# EasyEDA Pro project coBWeb.epro, schematic Schematic1

## Sheets
1 P1: Board Name: Board1; Create Date: 2025-08-11; Page Name: P1; Project Name: bwdevboard; Schematic Name: Schematic1; Update Date: 2025-08-13; Company: EasyEDA.com; Page Size: A4; Version: V1.0
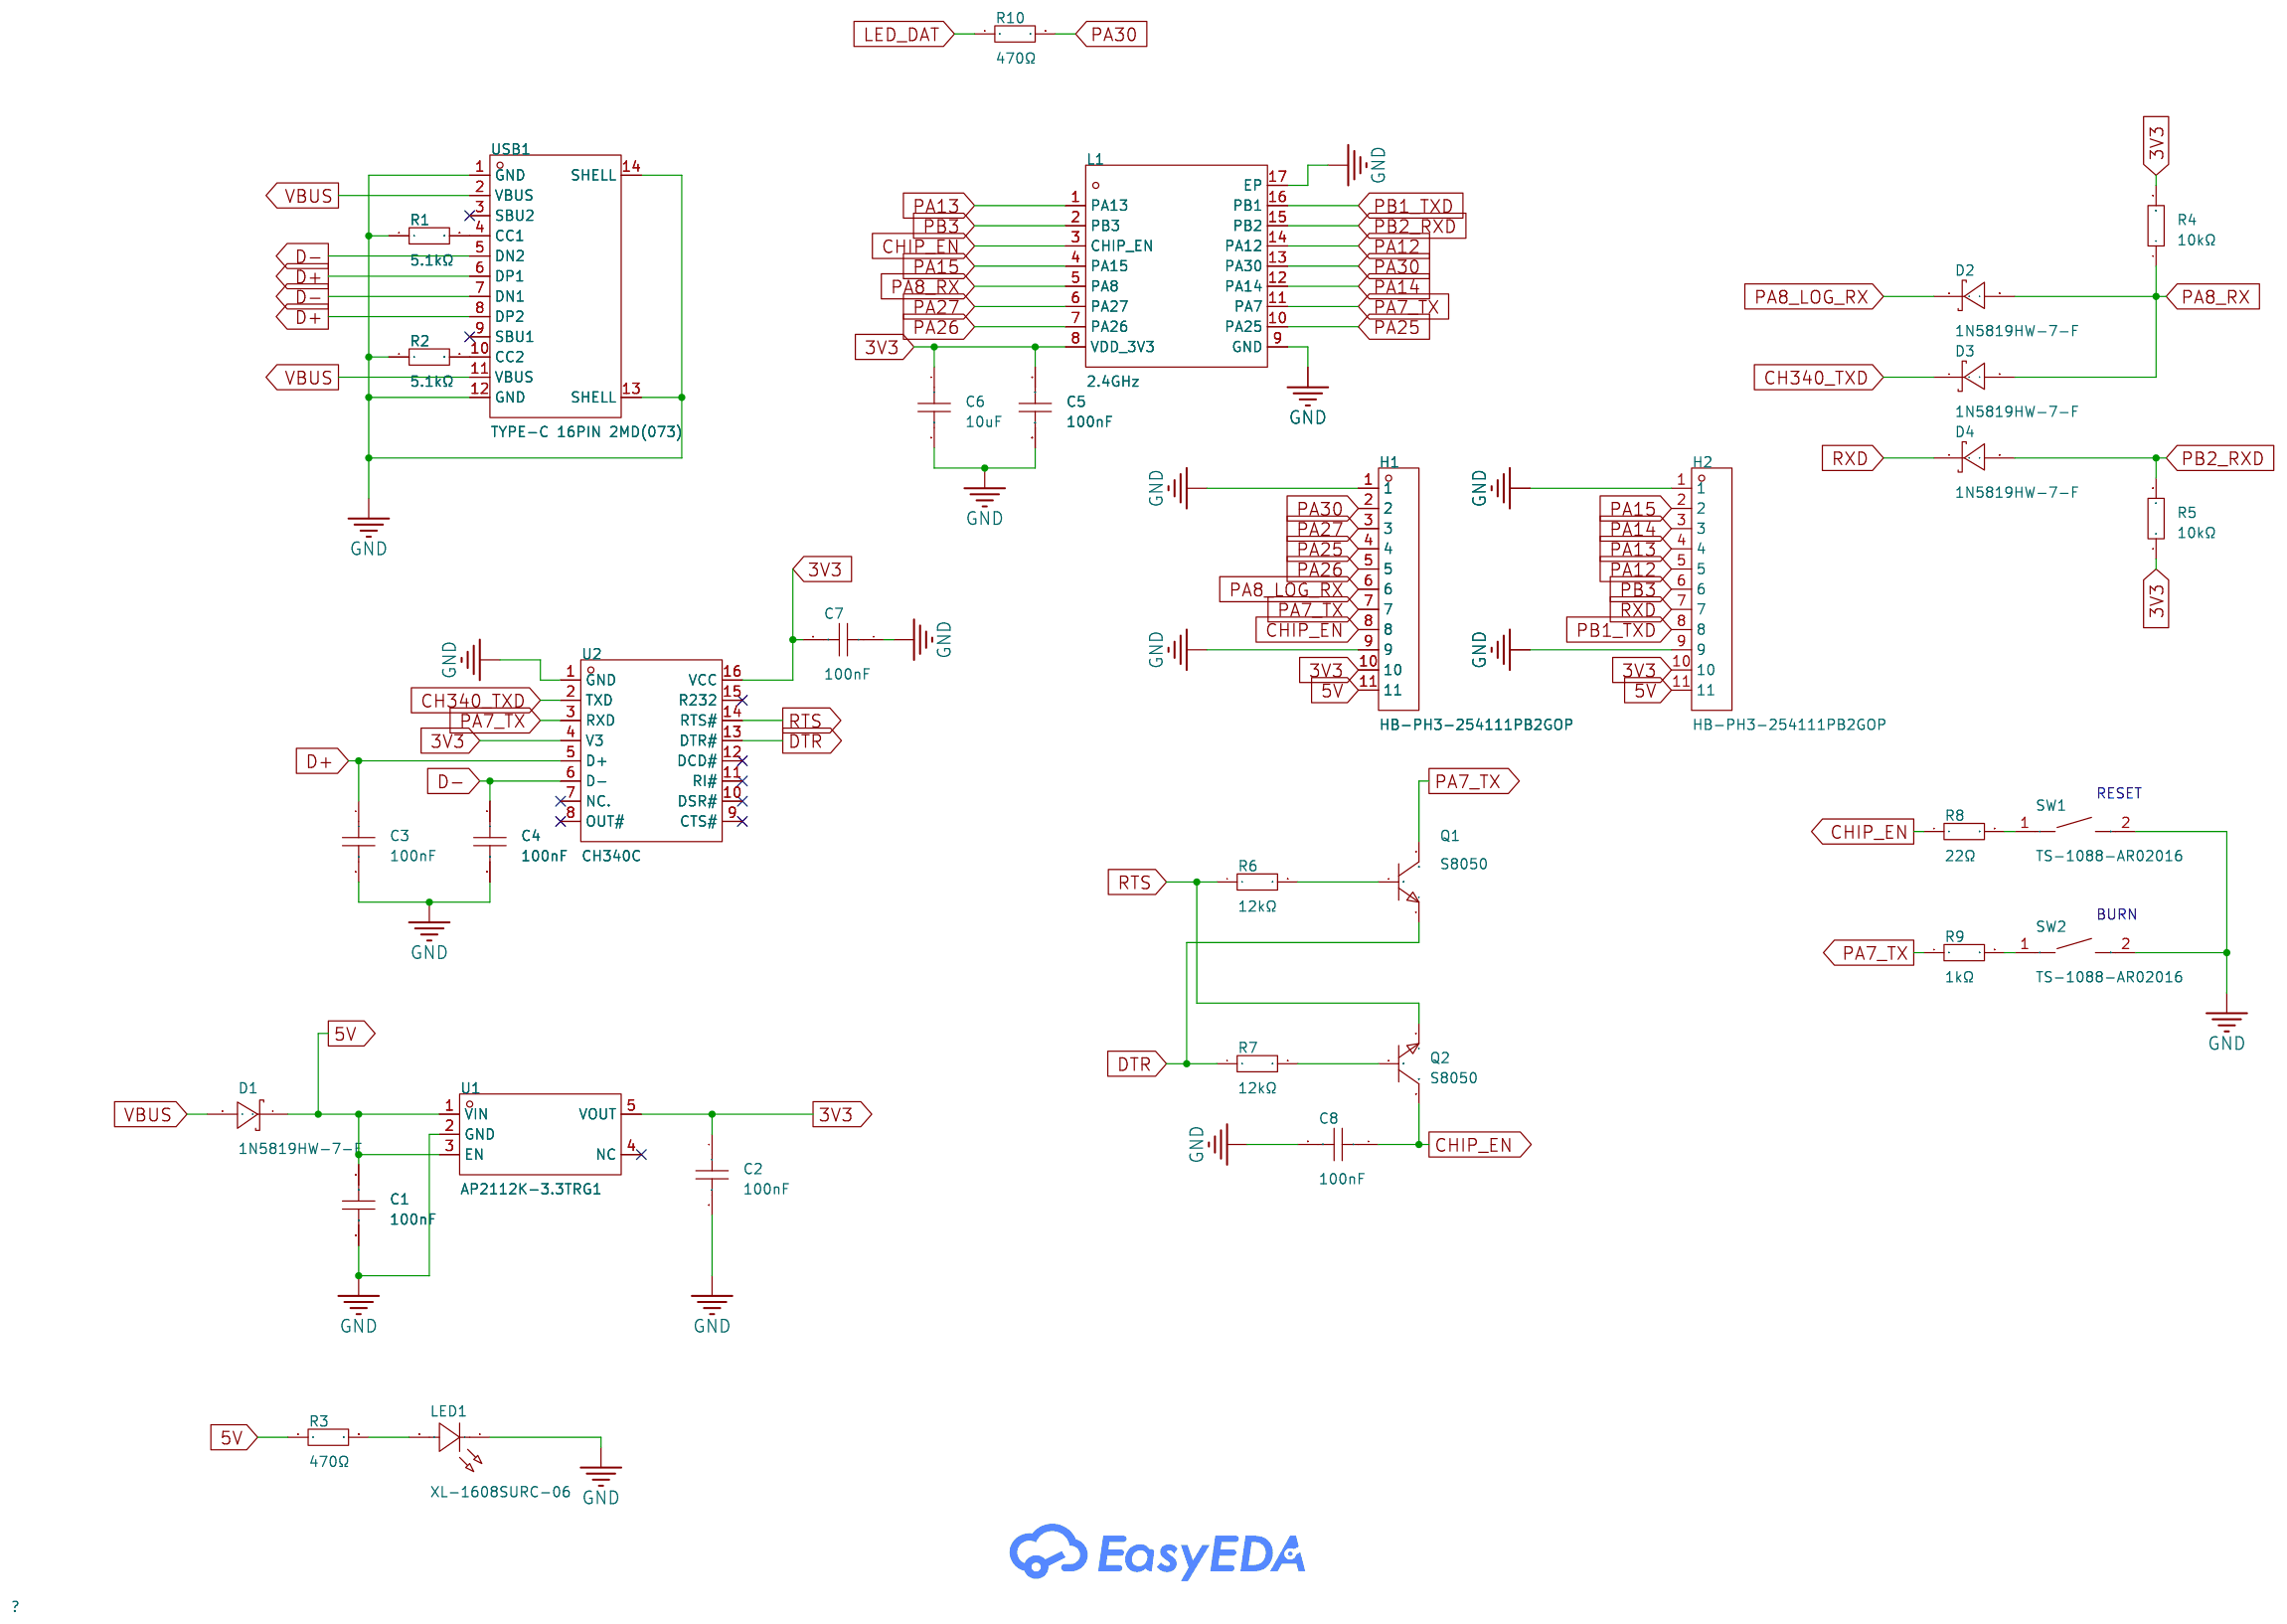
[diagram p0: P1]
2 P2: Create Date: 2025-08-12; Page Name: P2
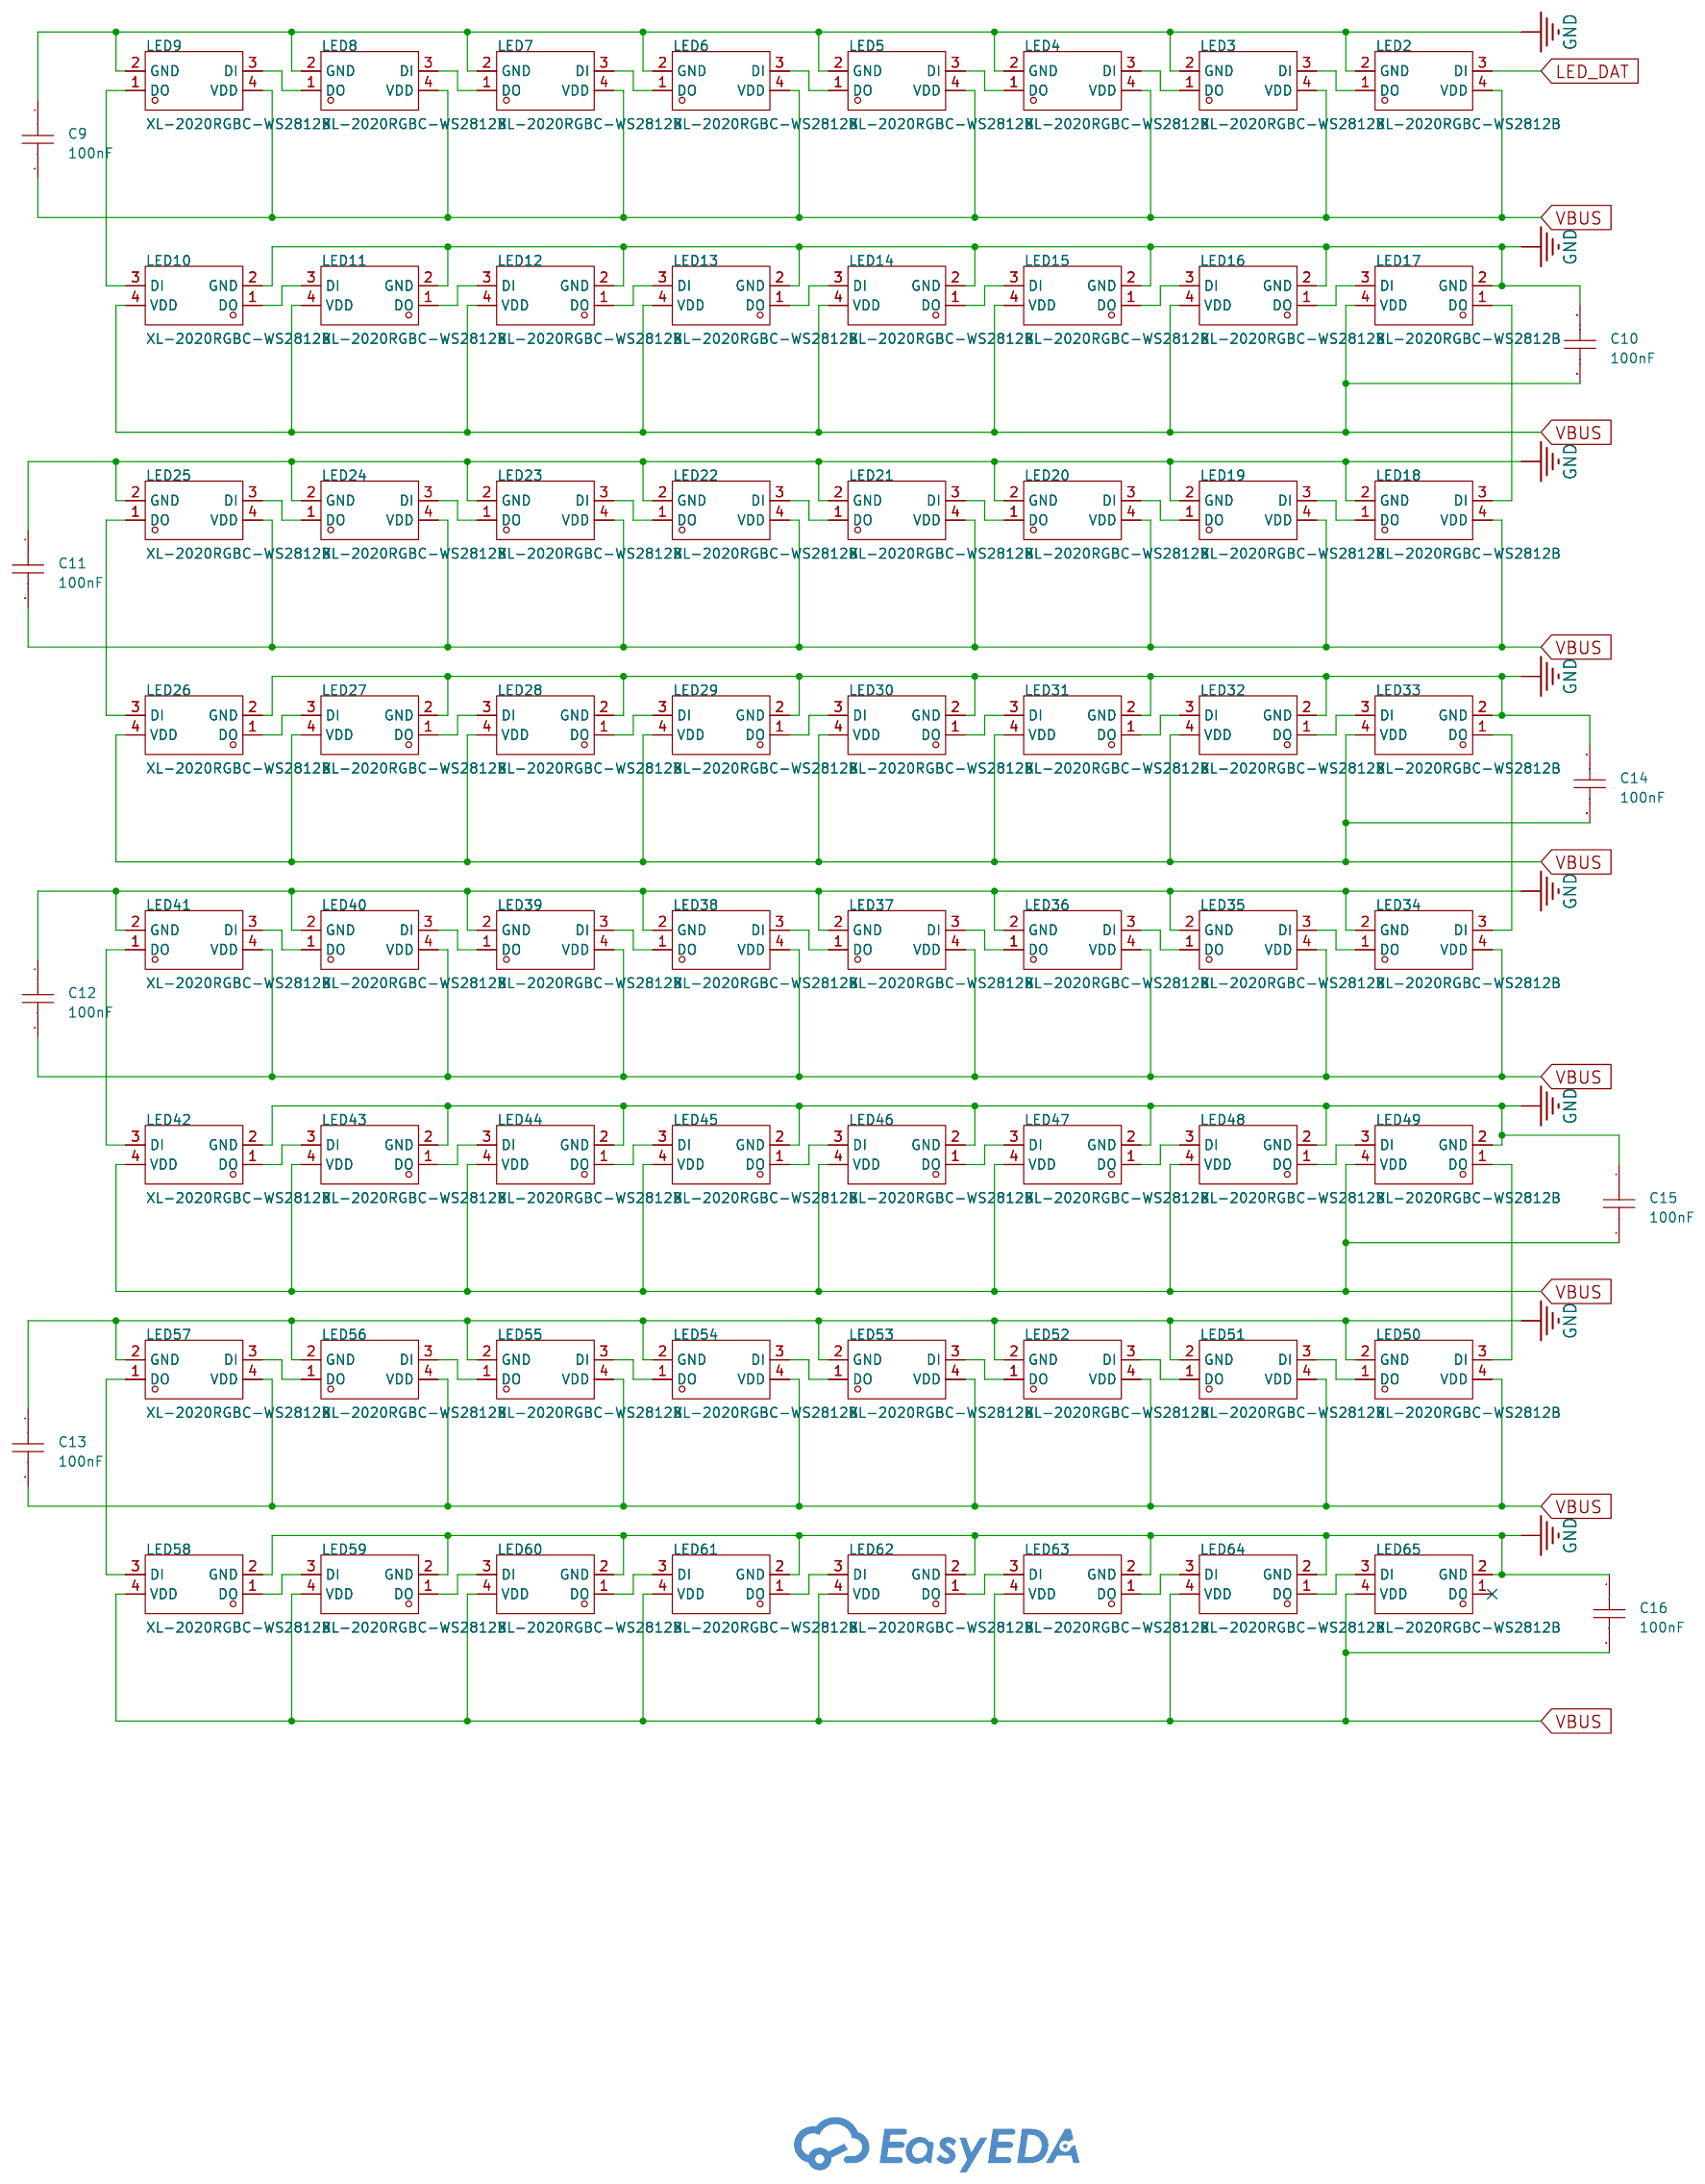
[diagram p1: P2]

## Parts
sheet P1
C1  100nF  [C0402]
C2  100nF  [C0402]
C3  100nF  [C0402]
C4  100nF  [C0402]
C5  100nF  [C0402]
C6  10uF  [C0402]
C7  100nF  [C0402]
C8  100nF  [C0402]
D1  1N5819HW-7-F  [SOD-123_L2.7-W1.6-LS3.7-RD]
D2  1N5819HW-7-F  [SOD-123_L2.7-W1.6-LS3.7-RD]
D3  1N5819HW-7-F  [SOD-123_L2.7-W1.6-LS3.7-RD]
D4  1N5819HW-7-F  [SOD-123_L2.7-W1.6-LS3.7-RD]
H1  HB-PH3-254111PB2GOP  [HDR-TH_11P-P2.54-V-M]
H2  HB-PH3-254111PB2GOP  [HDR-TH_11P-P2.54-V-M]
L1  2.4GHz  [WIFI-SMD_BW16]
LED1  XL-1608SURC-06  [LED0603-RD_RED]
Q1  S8050  [SOT-23-3_L2.9-W1.3-P1.90-LS2.4-BR]
Q2  S8050  [SOT-23-3_L2.9-W1.3-P1.90-LS2.4-BR]
R1  5.1kΩ  [R0402]
R2  5.1kΩ  [R0402]
R3  470Ω  [R0402]
R4  10kΩ  [R0402]
R5  10kΩ  [R0402]
R6  12kΩ  [R0402]
R7  12kΩ  [R0402]
R8  22Ω  [R0402]
R9  1kΩ  [R0402]
R10  470Ω  [R0402]
SW1  TS-1088-AR02016  [SW-SMD_L3.9-W3.0-P4.45]
SW2  TS-1088-AR02016  [SW-SMD_L3.9-W3.0-P4.45]
U1  AP2112K-3.3TRG1  [SOT-25-5_L2.9-W1.6-P0.95-LS2.8-BL]
U2  CH340C  [SOP-16_L10.0-W3.9-P1.27-LS6.0-BL]
USB1  TYPE-C 16PIN 2MD(073)  [USB-C-SMD_TYPE-C-6PIN-2MD-073]
sheet P2
C9  100nF  [C0402]
C10  100nF  [C0402]
C11  100nF  [C0402]
C12  100nF  [C0402]
C13  100nF  [C0402]
C14  100nF  [C0402]
C15  100nF  [C0402]
C16  100nF  [C0402]
LED2  XL-2020RGBC-WS2812B  [LED-SMD_4P-L2.0-W2.0-BR-1]
LED3  XL-2020RGBC-WS2812B  [LED-SMD_4P-L2.0-W2.0-BR-1]
LED4  XL-2020RGBC-WS2812B  [LED-SMD_4P-L2.0-W2.0-BR-1]
LED5  XL-2020RGBC-WS2812B  [LED-SMD_4P-L2.0-W2.0-BR-1]
LED6  XL-2020RGBC-WS2812B  [LED-SMD_4P-L2.0-W2.0-BR-1]
LED7  XL-2020RGBC-WS2812B  [LED-SMD_4P-L2.0-W2.0-BR-1]
LED8  XL-2020RGBC-WS2812B  [LED-SMD_4P-L2.0-W2.0-BR-1]
LED9  XL-2020RGBC-WS2812B  [LED-SMD_4P-L2.0-W2.0-BR-1]
LED10  XL-2020RGBC-WS2812B  [LED-SMD_4P-L2.0-W2.0-BR-1]
LED11  XL-2020RGBC-WS2812B  [LED-SMD_4P-L2.0-W2.0-BR-1]
LED12  XL-2020RGBC-WS2812B  [LED-SMD_4P-L2.0-W2.0-BR-1]
LED13  XL-2020RGBC-WS2812B  [LED-SMD_4P-L2.0-W2.0-BR-1]
LED14  XL-2020RGBC-WS2812B  [LED-SMD_4P-L2.0-W2.0-BR-1]
LED15  XL-2020RGBC-WS2812B  [LED-SMD_4P-L2.0-W2.0-BR-1]
LED16  XL-2020RGBC-WS2812B  [LED-SMD_4P-L2.0-W2.0-BR-1]
LED17  XL-2020RGBC-WS2812B  [LED-SMD_4P-L2.0-W2.0-BR-1]
LED18  XL-2020RGBC-WS2812B  [LED-SMD_4P-L2.0-W2.0-BR-1]
LED19  XL-2020RGBC-WS2812B  [LED-SMD_4P-L2.0-W2.0-BR-1]
LED20  XL-2020RGBC-WS2812B  [LED-SMD_4P-L2.0-W2.0-BR-1]
LED21  XL-2020RGBC-WS2812B  [LED-SMD_4P-L2.0-W2.0-BR-1]
LED22  XL-2020RGBC-WS2812B  [LED-SMD_4P-L2.0-W2.0-BR-1]
LED23  XL-2020RGBC-WS2812B  [LED-SMD_4P-L2.0-W2.0-BR-1]
LED24  XL-2020RGBC-WS2812B  [LED-SMD_4P-L2.0-W2.0-BR-1]
LED25  XL-2020RGBC-WS2812B  [LED-SMD_4P-L2.0-W2.0-BR-1]
LED26  XL-2020RGBC-WS2812B  [LED-SMD_4P-L2.0-W2.0-BR-1]
LED27  XL-2020RGBC-WS2812B  [LED-SMD_4P-L2.0-W2.0-BR-1]
LED28  XL-2020RGBC-WS2812B  [LED-SMD_4P-L2.0-W2.0-BR-1]
LED29  XL-2020RGBC-WS2812B  [LED-SMD_4P-L2.0-W2.0-BR-1]
LED30  XL-2020RGBC-WS2812B  [LED-SMD_4P-L2.0-W2.0-BR-1]
LED31  XL-2020RGBC-WS2812B  [LED-SMD_4P-L2.0-W2.0-BR-1]
LED32  XL-2020RGBC-WS2812B  [LED-SMD_4P-L2.0-W2.0-BR-1]
LED33  XL-2020RGBC-WS2812B  [LED-SMD_4P-L2.0-W2.0-BR-1]
LED34  XL-2020RGBC-WS2812B  [LED-SMD_4P-L2.0-W2.0-BR-1]
LED35  XL-2020RGBC-WS2812B  [LED-SMD_4P-L2.0-W2.0-BR-1]
LED36  XL-2020RGBC-WS2812B  [LED-SMD_4P-L2.0-W2.0-BR-1]
LED37  XL-2020RGBC-WS2812B  [LED-SMD_4P-L2.0-W2.0-BR-1]
LED38  XL-2020RGBC-WS2812B  [LED-SMD_4P-L2.0-W2.0-BR-1]
LED39  XL-2020RGBC-WS2812B  [LED-SMD_4P-L2.0-W2.0-BR-1]
LED40  XL-2020RGBC-WS2812B  [LED-SMD_4P-L2.0-W2.0-BR-1]
LED41  XL-2020RGBC-WS2812B  [LED-SMD_4P-L2.0-W2.0-BR-1]
LED42  XL-2020RGBC-WS2812B  [LED-SMD_4P-L2.0-W2.0-BR-1]
LED43  XL-2020RGBC-WS2812B  [LED-SMD_4P-L2.0-W2.0-BR-1]
LED44  XL-2020RGBC-WS2812B  [LED-SMD_4P-L2.0-W2.0-BR-1]
LED45  XL-2020RGBC-WS2812B  [LED-SMD_4P-L2.0-W2.0-BR-1]
LED46  XL-2020RGBC-WS2812B  [LED-SMD_4P-L2.0-W2.0-BR-1]
LED47  XL-2020RGBC-WS2812B  [LED-SMD_4P-L2.0-W2.0-BR-1]
LED48  XL-2020RGBC-WS2812B  [LED-SMD_4P-L2.0-W2.0-BR-1]
LED49  XL-2020RGBC-WS2812B  [LED-SMD_4P-L2.0-W2.0-BR-1]
LED50  XL-2020RGBC-WS2812B  [LED-SMD_4P-L2.0-W2.0-BR-1]
LED51  XL-2020RGBC-WS2812B  [LED-SMD_4P-L2.0-W2.0-BR-1]
LED52  XL-2020RGBC-WS2812B  [LED-SMD_4P-L2.0-W2.0-BR-1]
LED53  XL-2020RGBC-WS2812B  [LED-SMD_4P-L2.0-W2.0-BR-1]
LED54  XL-2020RGBC-WS2812B  [LED-SMD_4P-L2.0-W2.0-BR-1]
LED55  XL-2020RGBC-WS2812B  [LED-SMD_4P-L2.0-W2.0-BR-1]
LED56  XL-2020RGBC-WS2812B  [LED-SMD_4P-L2.0-W2.0-BR-1]
LED57  XL-2020RGBC-WS2812B  [LED-SMD_4P-L2.0-W2.0-BR-1]
LED58  XL-2020RGBC-WS2812B  [LED-SMD_4P-L2.0-W2.0-BR-1]
LED59  XL-2020RGBC-WS2812B  [LED-SMD_4P-L2.0-W2.0-BR-1]
LED60  XL-2020RGBC-WS2812B  [LED-SMD_4P-L2.0-W2.0-BR-1]
LED61  XL-2020RGBC-WS2812B  [LED-SMD_4P-L2.0-W2.0-BR-1]
LED62  XL-2020RGBC-WS2812B  [LED-SMD_4P-L2.0-W2.0-BR-1]
LED63  XL-2020RGBC-WS2812B  [LED-SMD_4P-L2.0-W2.0-BR-1]
LED64  XL-2020RGBC-WS2812B  [LED-SMD_4P-L2.0-W2.0-BR-1]
LED65  XL-2020RGBC-WS2812B  [LED-SMD_4P-L2.0-W2.0-BR-1]

## Library data of the parts
C1-C5 C7-C16 = CGA0402X7R104K160GT: Capacitance:100nF Tolerance:±10% Tolerance:±10% Voltage Rated: Temperature Coefficient:; LCSC Part Name: 100nF ±10% 16V; Supplier Part: C6119799; Manufacturer: HRE(芯声); Supplier Footprint: 0402; JLCPCB Part Class: Extended Part; Supplier: LCSC; Tolerance: ±10%
C6 = GRM155R60J106ME44D: Capacitance: Tolerance:±20% Tolerance:±20% Voltage Rated: Temperature Coefficient:; LCSC Part Name: 10uF ±20% 6.3V; Supplier Part: C76991; Manufacturer: muRata(村田); Supplier Footprint: 0402; JLCPCB Part Class: Extended Part; Datasheet: https://atta.szlcsc.com/upload/public/pdf/source/20200305/C490387_23319AE8C154DEB24C505E6C82A8106A.pdf; Supplier: LCSC; Tolerance: ±20%
D1-D4 = 1N5819HW-7-F: Forward Voltage (Vf@If):450mV@1A Reverse Voltage (Vr):40V Rectified Current:1A Reverse Leakage Current (Ir):1mA@40V; LCSC Part Name: 电压:40V 电流:1A; Supplier Part: C82544; Manufacturer: DIODES(美台); Supplier Footprint: SOD-123; JLCPCB Part Class: Extended Part; Datasheet: https://atta.szlcsc.com/upload/public/pdf/source/20161024/1477288459223.pdf; Supplier: LCSC; Forward Voltage (Vf@If): 450mV@1A; Reverse Voltage (Vr): 40V; Rectified Current: 1A; Reverse Leakage Current (Ir): 1mA@40V
H1 H2 = HB-PH3-254111PB2GOP: Pin Structure:1x11P Pitch:2.54mm Row Spacing:2.54mm Circluar Pins/Square Pins:Policy Mounting Type:Straight Number of Rows:Single Row Number of Pins:11P Current Rating:3A Voltage Rating (Max):250V Length of Mating Pin:6mm Insulation Height:2.54mm Length o; LCSC Part Name: 1x11P 间距:2.54mm 方针 直插; Supplier Part: C6332204; Manufacturer: HANBO(汉博); Supplier Footprint: 插件,P=2.54mm; JLCPCB Part Class: Extended Part; Datasheet: https://atta.szlcsc.com/upload/public/pdf/source/20230803/F72D259687963761DF1B552F3BB84A31.pdf; Supplier: LCSC; Pin Structure: 1x11P; Pitch: 2.54mm; Row Spacing: 2.54mm; Circluar Pins/Square Pins: Policy; Mounting Type: Straight; Number of Rows: Single Row; Number of Pins: 11P; Current Rating: 3A; Voltage Rating (Max): 250V; Length of Mating Pin: 6mm; Insulation Height: 2.54mm; Length of End Connection Pin: 3mm; Contact Material: Brass; Contact Plating: Gold; Operating Temperature: -40℃~+105℃; Color: Black
L1 = BW16: Core Processor:RTL8720DN Chip Wireless Standard:802.11a/b/g/n；BLE5.0 Support Interface:GPIO Frequency:2.4GHz Antenna Type:On-Board PCB Antenna Output Power:16dBm Output Power:16dBm Operating Voltage:3.3V Operating Voltage:3.3V Receive  Current:- Send  Cur; Supplier Part: C2764067; Manufacturer: Ai-Thinker(安信可); Supplier Footprint: SMD,16x24mm; JLCPCB Part Class: Extended Part; Datasheet: https://atta.szlcsc.com/upload/public/pdf/source/20210401/C2764067_693C1F68E98425ED6542274C1CB485A4.pdf; Supplier: LCSC; Core Processor: RTL8720DN Chip; Wireless Standard: 802.11a/b/g/n；BLE5.0; Support Interface: GPIO; Antenna Type: On-Board PCB Antenna; Output Power: 16dBm; Operating Voltage: 3.3V; Sensitivity: -90dBm; Operating Temperature: -40℃~+85℃
LED1 = XL-1608SURC-06: Lamp Holder Type:- Illumination Color:Red Voltage - Forward(Vf):2.3V Voltage - Forward(Vf):2.3V Power(Watts):50mW Forward Current:20mA Wavelength - Dominant:620nm~630nm Wavelength - Dominant:620nm~630nm Peak Wavelength:625nm Diode Configuration:- Lens Col; Supplier Part: C965799; Manufacturer: XINGLIGHT(成兴光); Supplier Footprint: 0603; JLCPCB Part Class: Extended Part; Datasheet: https://atta.szlcsc.com/upload/public/pdf/source/20250213/F9766CE804AF391355DCDD48DB3E0DAB.pdf; Supplier: LCSC; Illumination Color: Red; Voltage - Forward(Vf): 2.3V; Power(Watts): 50mW; Forward Current: 20mA; Wavelength - Dominant: 620nm~630nm; Peak Wavelength: 625nm; Lens Color: Colorless Transparent Lens; Luminous Intensity: 225mcd; Viewing Angle: 120°; Mounting Sytle: Positive Stick; Operating Temperature: -20℃~+85℃
Q1 Q2 = S8050_C916390: type:- Current - Collector(Ic): Collector - Emitter Voltage VCEO: Pd - Power Dissipation:300mW Transition frequency(fT):150MHz Current - Collector Cutoff:100nA Vce Saturation(VCE(sat)):600mV Operating Temperature:150℃@(Tj) Operating Temperature:150℃@(Tj); Supplier Part: C916390; Manufacturer: JSMSEMI(杰盛微); Supplier Footprint: SOT-23; JLCPCB Part Class: Extended Part; Datasheet: https://atta.szlcsc.com/upload/public/pdf/source/20230807/2EB23ED2C820E6EDA7BD0AA9F6E62B00.pdf; Supplier: LCSC; Pd - Power Dissipation: 300mW; Transition frequency(fT): 150MHz; Current - Collector Cutoff: 100nA; Vce Saturation(VCE(sat)): 600mV; Operating Temperature: 150℃@(Tj)
R1 R2 = 0402WGF5101TCE: Type:Thick Film Resistor Resistance:5.1kΩ Tolerance:±1% Tolerance:±1% Power(Watts):62.5mW Voltage-Supply(Max):50V Temperature Coefficient:±100ppm/℃ Temperature Coefficient:±100ppm/℃ Operating Temperature:-55℃~+155℃ Operating Temperature:-55℃~+155℃; LCSC Part Name: 5.1kΩ ±1% 62.5mW 厚膜电阻; Supplier Part: C25905; Manufacturer: UNI-ROYAL(厚声); Supplier Footprint: 0402; JLCPCB Part Class: Basic Part; Datasheet: https://atta.szlcsc.com/upload/public/pdf/source/20200306/C422600_1E6D84923E4A46A82E41ADD87F860B5C.pdf; Supplier: LCSC; Type: Thick Film Resistor; Tolerance: ±1%; Power(Watts): 62.5mW; Voltage-Supply(Max): 50V; Temperature Coefficient: ±100ppm/℃; Operating Temperature: -55℃~+155℃
R3 R10 = RC0402FR-07470RL: Type:Thick Film Resistor Resistance:470Ω Tolerance:±1% Tolerance:±1% Power(Watts):62.5mW Voltage-Supply(Max):50V Temperature Coefficient:±100ppm/℃ Temperature Coefficient:±100ppm/℃ Operating Temperature:-55℃~+155℃ Operating Temperature:-55℃~+155℃; LCSC Part Name: 厚膜电阻 470Ω ±1% 62.5mW; Supplier Part: C114877; Manufacturer: YAGEO(国巨); Supplier Footprint: 0402; JLCPCB Part Class: Extended Part; Datasheet: https://atta.szlcsc.com/upload/public/pdf/source/20250610/89E4D743C004A82A45145C7A2CC3A578.pdf; Supplier: LCSC; Type: Thick Film Resistor; Tolerance: ±1%; Power(Watts): 62.5mW; Voltage-Supply(Max): 50V; Temperature Coefficient: ±100ppm/℃; Operating Temperature: -55℃~+155℃
R4 R5 = 0402WGF1002TCE: Type:Thick Film Resistors Resistance:10kΩ Tolerance:±1% Tolerance:±1% Power(Watts): Overload Voltage (Max): Temperature Coefficient:±100ppm/℃ Temperature Coefficient:±100ppm/℃ Operating Temperature Range:-55℃~+155℃ Operating Temperature Range:-55℃~+155℃; LCSC Part Name: 10kΩ ±1% 62.5mW 厚膜电阻; Supplier Part: C25744; Manufacturer: UNI-ROYAL(厚声); Supplier Footprint: 0402; JLCPCB Part Class: Basic Part; Datasheet: https://atta.szlcsc.com/upload/public/pdf/source/20200306/C422600_1E6D84923E4A46A82E41ADD87F860B5C.pdf; Supplier: LCSC; Type: Thick Film Resistors; Tolerance: ±1%; Temperature Coefficient: ±100ppm/℃; Operating Temperature Range: -55℃~+155℃
R6 R7 = RTT021202FTH: Type:Thick Film Resistors Resistance: Tolerance:±1% Tolerance:±1% Power(Watts): Overload Voltage (Max): Temperature Coefficient:±100ppm/℃ Temperature Coefficient:±100ppm/℃ Operating Temperature Range:-55℃~+155℃ Operating Temperature Range:-55℃~+155℃; LCSC Part Name: 厚膜电阻 12kΩ ±1% 62.5mW; Supplier Part: C102781; Manufacturer: RALEC(旺诠); Supplier Footprint: 0402; JLCPCB Part Class: Extended Part; Datasheet: https://atta.szlcsc.com/upload/public/pdf/source/20191219/C158410_884373A5B7E1BC76BF57BC45A946C093.pdf; Supplier: LCSC; Type: Thick Film Resistors; Tolerance: ±1%; Temperature Coefficient: ±100ppm/℃; Operating Temperature Range: -55℃~+155℃
R8 = 0402WGF220JTCE: Type:Thick Film Resistors Resistance:22Ω Tolerance:±1% Tolerance:±1% Power(Watts): Overload Voltage (Max): Temperature Coefficient:±100ppm/℃ Temperature Coefficient:±100ppm/℃ Operating Temperature Range:-55℃~+155℃ Operating Temperature Range:-55℃~+155℃; LCSC Part Name: 22Ω ±1% 62.5mW 厚膜电阻; Supplier Part: C25092; Manufacturer: UNI-ROYAL(厚声); Supplier Footprint: 0402; JLCPCB Part Class: Basic Part; Datasheet: https://atta.szlcsc.com/upload/public/pdf/source/20200306/C422600_1E6D84923E4A46A82E41ADD87F860B5C.pdf; Supplier: LCSC; Type: Thick Film Resistors; Tolerance: ±1%; Temperature Coefficient: ±100ppm/℃; Operating Temperature Range: -55℃~+155℃
R9 = 0402WGF1001TCE: Type:Thick Film Resistors Resistance:1kΩ Tolerance:±1% Tolerance:±1% Power(Watts): Overload Voltage (Max): Temperature Coefficient:±100ppm/℃ Temperature Coefficient:±100ppm/℃ Operating Temperature Range:-55℃~+155℃ Operating Temperature Range:-55℃~+155℃; LCSC Part Name: 1kΩ ±1% 62.5mW 厚膜电阻; Supplier Part: C11702; Manufacturer: UNI-ROYAL(厚声); Supplier Footprint: 0402; JLCPCB Part Class: Basic Part; Datasheet: https://atta.szlcsc.com/upload/public/pdf/source/20200306/C422600_1E6D84923E4A46A82E41ADD87F860B5C.pdf; Supplier: LCSC; Type: Thick Film Resistors; Tolerance: ±1%; Temperature Coefficient: ±100ppm/℃; Operating Temperature Range: -55℃~+155℃
SW1 SW2 = TS-1088-AR02016: Circuit:SPST Actuator Style:Round Button Operating Force:160gf Mounting Style:Brick nogging Switch Length:4mm Switch Width:3mm Switch Height:2mm Strike Gundam:不带 Contact Current:50mA Voltage Rating (DC):12V Insulation Resistance:100MΩ Actuator/Cap Color:B; LCSC Part Name: 4*3*2mm 立贴 轻触开关; Supplier Part: C720477; Manufacturer: XUNPU(讯普); Supplier Footprint: SMD; JLCPCB Part Class: Basic Part; Datasheet: https://atta.szlcsc.com/upload/public/pdf/source/20200810/C720475_60D09DD6C54279ADDB2DC25100F1CC11.pdf; Supplier: LCSC; Circuit: SPST; Actuator Style: Round Button; Operating Force: 160gf; Mounting Style: Brick nogging; Switch Length: 4mm; Switch Width: 3mm; Switch Height: 2mm; Strike Gundam: 不带; Contact Current: 50mA; Voltage Rating (DC): 12V; Insulation Resistance: 100MΩ; Actuator/Cap Color: Black; Pin Style: SMDSplicing; Mechanical Life: 10万次; Operating Temperature: -30℃~+80℃
U1 = AP2112K-3.3TRG1: Output Type:Fixed Voltage - Supply:6V Output Voltage:3.3V Output Voltage:3.3V Output Current:600mA Power Supply Rejection Ratio (PSRR):65dB@(1kHz) Voltage Dropout:250mV@(600mA) standby current:55uA Noise:50uVrms Features:Enable；Over Temperature Protection; LCSC Part Name: 输入6V 输出3.3V 600mA; Supplier Part: C51118; Manufacturer: DIODES(美台); Supplier Footprint: SOT-25-5; JLCPCB Part Class: Extended Part; Datasheet: https://item.szlcsc.com/datasheet/AP2112K-3.3TRG1/52131.html; Supplier: LCSC; Output Type: Fixed; Voltage - Supply: 6V; Output Voltage: 3.3V; Output Current: 600mA; Power Supply Rejection Ratio (PSRR): 65dB@(1kHz); Voltage Dropout: 250mV@(600mA); standby current: 55uA; Noise: 50uVrms; Features: Enable；Over Temperature Protection；Over Current Protection; Operating Temperature: -40℃~+85℃@(Ta); Output Configuration: Positive; Number of Outputs: 1
U2 = CH340C: Applications Function:Transceiver USB Protocol:USB 2.0 Voltage - Supply:3.3V；5V Voltage - Supply:3.3V；5V Data Rate:2Mbps; Supplier Part: C84681; Manufacturer: WCH(南京沁恒); Supplier Footprint: SOP-16; JLCPCB Part Class: Extended Part; Datasheet: https://atta.szlcsc.com/upload/public/pdf/source/20250604/33626338A5406B1E2A8163A86C0531AF.pdf; Supplier: LCSC; Applications Function: Transceiver; USB Protocol: USB 2.0; Voltage - Supply: 3.3V；5V; Data Rate: 2Mbps
USB1 = TYPE-C 16PIN 2MD(073): Connector Type:Type-C Protocol Standard:USB 3.1 Gender:Female Mounting Type:Surface Mount, Right Angle Number of Contacts:16P Number of Ports:1 Current Rating-Power:3A Voltage Rating:5V Connect-Disconnect Life:5,000 Cycles Supplementary Features:- Center; LCSC Part Name: Type-C 母 卧贴; Supplier Part: C2765186; Manufacturer: SHOU HAN(首韩); Supplier Footprint: SMD; JLCPCB Part Class: Extended Part; Datasheet: https://item.szlcsc.com/datasheet/TYPE-C%252016PIN%25202MD(073)/2901843.html; Supplier: LCSC; Connector Type: Type-C; Protocol Standard: USB 3.1; Gender: Female; Mounting Type: Surface Mount, Right Angle; Number of Contacts: 16P; Number of Ports: 1; Current Rating-Power: 3A; Voltage Rating: 5V; Connect-Disconnect Life: 5,000 Cycles; Detection color: Black; Operating Temperature: -25℃~+85℃
LED2-LED65 = XL-2020RGBC-WS2812B: Wavelength:620nm~625nm；470nm~475nm；525nm~530nm Luminous Intensity:150mcd；150mcd；400mcd Lens Color:Translucent Fog Lens Installation method:Positive Stick Operating Temperature:-20℃~+85℃; LCSC Part Name: 幻彩透明 XL-2020RGBC-WS2812B; Supplier Part: C5349955; Manufacturer: XINGLIGHT(成兴光); Supplier Footprint: 2020; JLCPCB Part Class: Extended Part; Datasheet: https://atta.szlcsc.com/upload/public/pdf/source/20250225/AD3907CFC32050B2CE884C0832A15409.pdf; Supplier: LCSC; Wavelength: 620nm~625nm；470nm~475nm；525nm~530nm; Luminous Intensity: 150mcd；150mcd；400mcd; Lens Color: Translucent Fog Lens; Installation method: Positive Stick; Operating Temperature: -20℃~+85℃

## Nets
3V3: C2.1 C5.1 C6.1 C7.2 H1.10 H2.10 L1.8(VDD_3V3) R4.2 R5.1 U1.5(VOUT) U2.4(V3) U2.16(VCC)
5V: C1.1 D1.1(K) H1.11 H2.11 R3.1 U1.1(VIN) U1.3(EN)
GND: C1.2 C2.2 C3.2 C4.2 C5.2 C6.2 C7.1 C8.2 C9.1 C10.1 C11.1 C12.1 C13.1 C14.1 C15.1 C16.1 H1.1 H1.9 H2.1 H2.9 L1.9(GND) L1.17(EP) LED1.1(K) LED2.2(GND) LED3.2(GND) LED4.2(GND) LED5.2(GND) LED6.2(GND) LED7.2(GND) LED8.2(GND) LED9.2(GND) LED10.2(GND) LED11.2(GND) LED12.2(GND) LED13.2(GND) LED14.2(GND) LED15.2(GND) LED16.2(GND) LED17.2(GND) LED18.2(GND) LED19.2(GND) LED20.2(GND) LED21.2(GND) LED22.2(GND) LED23.2(GND) LED24.2(GND) LED25.2(GND) LED26.2(GND) LED27.2(GND) LED28.2(GND) LED29.2(GND) LED30.2(GND) LED31.2(GND) LED32.2(GND) LED33.2(GND) LED34.2(GND) LED35.2(GND) LED36.2(GND) LED37.2(GND) LED38.2(GND) LED39.2(GND) LED40.2(GND) LED41.2(GND) LED42.2(GND) LED43.2(GND) LED44.2(GND) LED45.2(GND) LED46.2(GND) LED47.2(GND) LED48.2(GND) LED49.2(GND) LED50.2(GND) LED51.2(GND) LED52.2(GND) LED53.2(GND) LED54.2(GND) LED55.2(GND) LED56.2(GND) LED57.2(GND) LED58.2(GND) LED59.2(GND) LED60.2(GND) LED61.2(GND) LED62.2(GND) LED63.2(GND) LED64.2(GND) LED65.2(GND) R1.1 R2.1 SW1.2 SW2.2 U1.2(GND) U2.1(GND) USB1.1(GND) USB1.12(GND) USB1.13(SHELL) USB1.14(SHELL)
VBUS: C9.2 C10.2 C11.2 C12.2 C13.2 C14.2 C15.2 C16.2 D1.2(A) LED2.4(VDD) LED3.4(VDD) LED4.4(VDD) LED5.4(VDD) LED6.4(VDD) LED7.4(VDD) LED8.4(VDD) LED9.4(VDD) LED10.4(VDD) LED11.4(VDD) LED12.4(VDD) LED13.4(VDD) LED14.4(VDD) LED15.4(VDD) LED16.4(VDD) LED17.4(VDD) LED18.4(VDD) LED19.4(VDD) LED20.4(VDD) LED21.4(VDD) LED22.4(VDD) LED23.4(VDD) LED24.4(VDD) LED25.4(VDD) LED26.4(VDD) LED27.4(VDD) LED28.4(VDD) LED29.4(VDD) LED30.4(VDD) LED31.4(VDD) LED32.4(VDD) LED33.4(VDD) LED34.4(VDD) LED35.4(VDD) LED36.4(VDD) LED37.4(VDD) LED38.4(VDD) LED39.4(VDD) LED40.4(VDD) LED41.4(VDD) LED42.4(VDD) LED43.4(VDD) LED44.4(VDD) LED45.4(VDD) LED46.4(VDD) LED47.4(VDD) LED48.4(VDD) LED49.4(VDD) LED50.4(VDD) LED51.4(VDD) LED52.4(VDD) LED53.4(VDD) LED54.4(VDD) LED55.4(VDD) LED56.4(VDD) LED57.4(VDD) LED58.4(VDD) LED59.4(VDD) LED60.4(VDD) LED61.4(VDD) LED62.4(VDD) LED63.4(VDD) LED64.4(VDD) LED65.4(VDD) USB1.2(VBUS) USB1.11(VBUS)
CH340_TXD: D3.1(K) U2.2(TXD)
CHIP_EN: C8.1 H1.8 L1.3(CHIP_EN) Q2.3(C) R8.1
D+: C3.1 U2.5(D+) USB1.6(DP1) USB1.8(DP2)
D-: C4.1 U2.6(D-) USB1.5(DN2) USB1.7(DN1)
DTR: Q1.2(E) R7.1 U2.13(DTR#)
LED_DAT: LED2.3(DI) R10.1
PA7_TX: H1.7 L1.11(PA7) Q1.3(C) R9.1 U2.3(RXD)
PA8_LOG_RX: D2.1(K) H1.6
PA8_RX: D2.2(A) D3.2(A) L1.5(PA8) R4.1
PA12: H2.5 L1.14(PA12)
PA13: H2.4 L1.1(PA13)
PA14: H2.3 L1.12(PA14)
PA15: H2.2 L1.4(PA15)
PA25: H1.4 L1.10(PA25)
PA26: H1.5 L1.7(PA26)
PA27: H1.3 L1.6(PA27)
PA30: H1.2 L1.13(PA30) R10.2
PB1_TXD: H2.8 L1.16(PB1)
PB2_RXD: D4.2(A) L1.15(PB2) R5.2
PB3: H2.6 L1.2(PB3)
RTS: Q2.2(E) R6.1 U2.14(RTS#)
RXD: D4.1(K) H2.7
$1N319: R1.2 USB1.4(CC1)
$1N345: R2.2 USB1.10(CC2)
$1N1416: LED1.2(A) R3.2
$1N3534: Q1.1(B) R6.2
$1N3690: Q2.1(B) R7.2
$1N4083: R9.2 SW2.1
$1N4093: R8.2 SW1.1
$2N39191: LED2.1(DO) LED3.3(DI)
$2N39277: LED4.1(DO) LED5.3(DI)
$2N39445: LED6.1(DO) LED7.3(DI)
$2N39449: LED8.1(DO) LED9.3(DI)
$2N39455: LED3.1(DO) LED4.3(DI)
$2N39461: LED5.1(DO) LED6.3(DI)
$2N39468: LED7.1(DO) LED8.3(DI)
$2N39874: LED9.1(DO) LED10.3(DI)
$2N39921: LED10.1(DO) LED11.3(DI)
$2N40007: LED12.1(DO) LED13.3(DI)
$2N40013: LED11.1(DO) LED12.3(DI)
$2N40184: LED14.1(DO) LED15.3(DI)
$2N40188: LED16.1(DO) LED17.3(DI)
$2N40194: LED15.1(DO) LED16.3(DI)
$2N40200: LED13.1(DO) LED14.3(DI)
$2N40861: LED18.1(DO) LED19.3(DI)
$2N40865: LED20.1(DO) LED21.3(DI)
$2N40869: LED22.1(DO) LED23.3(DI)
$2N40873: LED24.1(DO) LED25.3(DI)
$2N40877: LED19.1(DO) LED20.3(DI)
$2N40881: LED21.1(DO) LED22.3(DI)
$2N40885: LED23.1(DO) LED24.3(DI)
$2N40889: LED25.1(DO) LED26.3(DI)
$2N40893: LED26.1(DO) LED27.3(DI)
$2N40897: LED28.1(DO) LED29.3(DI)
$2N40901: LED27.1(DO) LED28.3(DI)
$2N40905: LED30.1(DO) LED31.3(DI)
$2N40909: LED32.1(DO) LED33.3(DI)
$2N40913: LED31.1(DO) LED32.3(DI)
$2N40917: LED29.1(DO) LED30.3(DI)
$2N40927: LED17.1(DO) LED18.3(DI)
$2N42244: LED42.1(DO) LED43.3(DI)
$2N42248: LED44.1(DO) LED45.3(DI)
$2N42252: LED43.1(DO) LED44.3(DI)
$2N42256: LED57.1(DO) LED58.3(DI)
$2N42260: LED58.1(DO) LED59.3(DI)
$2N42264: LED61.1(DO) LED62.3(DI)
$2N42268: LED59.1(DO) LED60.3(DI)
$2N42272: LED60.1(DO) LED61.3(DI)
$2N42276: LED62.1(DO) LED63.3(DI)
$2N42280: LED53.1(DO) LED54.3(DI)
$2N42284: LED56.1(DO) LED57.3(DI)
$2N42288: LED55.1(DO) LED56.3(DI)
$2N42292: LED52.1(DO) LED53.3(DI)
$2N42296: LED54.1(DO) LED55.3(DI)
$2N42300: LED39.1(DO) LED40.3(DI)
$2N42304: LED38.1(DO) LED39.3(DI)
$2N42308: LED37.1(DO) LED38.3(DI)
$2N42312: LED48.1(DO) LED49.3(DI)
$2N42316: LED50.1(DO) LED51.3(DI)
$2N42320: LED64.1(DO) LED65.3(DI)
$2N42324: LED36.1(DO) LED37.3(DI)
$2N42328: LED35.1(DO) LED36.3(DI)
$2N42332: LED34.1(DO) LED35.3(DI)
$2N42336: LED45.1(DO) LED46.3(DI)
$2N42340: LED46.1(DO) LED47.3(DI)
$2N42344: LED51.1(DO) LED52.3(DI)
$2N42348: LED63.1(DO) LED64.3(DI)
$2N42352: LED47.1(DO) LED48.3(DI)
$2N42356: LED40.1(DO) LED41.3(DI)
$2N42360: LED41.1(DO) LED42.3(DI)
$2N42364: LED49.1(DO) LED50.3(DI)
$2N42370: LED33.1(DO) LED34.3(DI)

Not connected (* = marked no-connect by the designer): LED65 1(DO)*; U1 4(NC)*; U2 7(NC.)* 8(OUT#)* 9(CTS#)* 10(DSR#)* 11(RI#)* 12(DCD#)* 15(R232)*; USB1 3(SBU2)* 9(SBU1)*

## Notes on the sheets
sheet 1
- RESET
- BURN
